# EAGLE design Rover-8_Power_Supply (EAGLE 7.7.0)
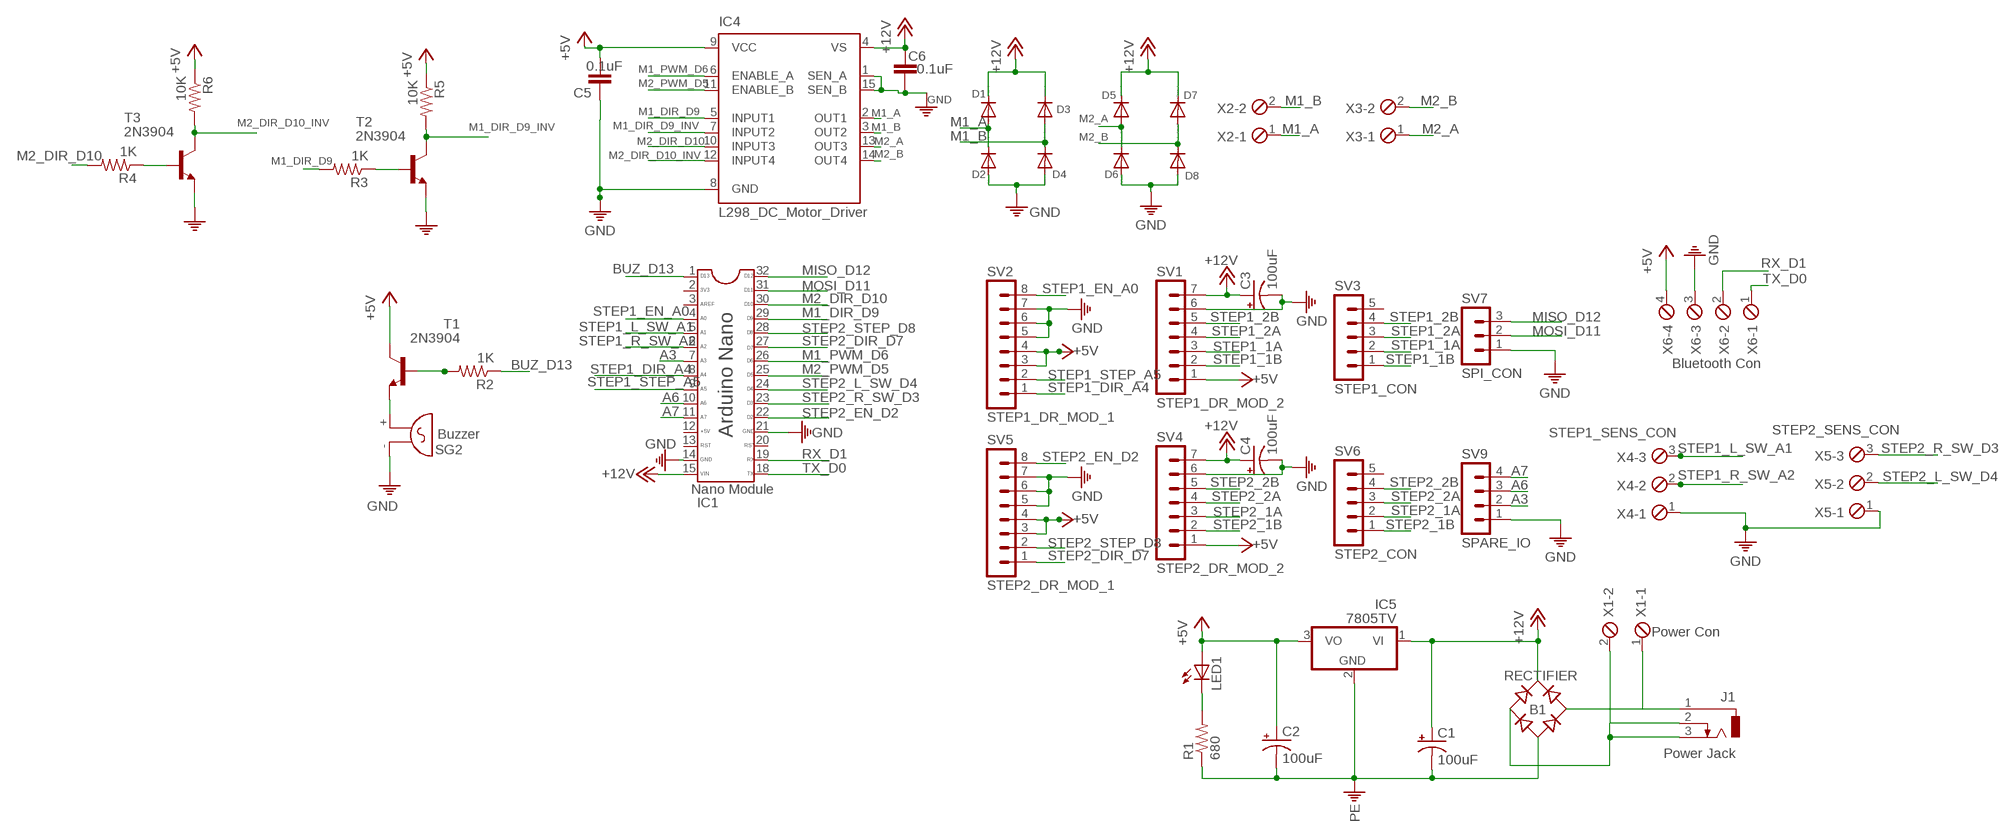
[diagram p0: schematic, sheet 1]

## Parts
B1  RECTIFIER  RB1A  [RB1A]
C1  100uF  CPOL-USE1.8-4  [E1,8-4]
C2  100uF  CPOL-USE1.8-4  [E1,8-4]
C3  100uF  CPOL-USE1.8-4  [E1,8-4]
C4  100uF  CPOL-USE1.8-4  [E1,8-4]
C5  0.1uF  C-EU025-024X044  [C025-024X044]
C6  0.1uF  C-EU025-024X044  [C025-024X044]
D1  DIODE-D-2.5  [D-2.5]
D2  DIODE-D-2.5  [D-2.5]
D3  DIODE-D-2.5  [D-2.5]
D4  DIODE-D-2.5  [D-2.5]
D5  DIODE-D-2.5  [D-2.5]
D6  DIODE-D-2.5  [D-2.5]
D7  DIODE-D-2.5  [D-2.5]
D8  DIODE-D-2.5  [D-2.5]
IC1  Nano Module  DIL32  [DIL32]
IC4  L298_DC_Motor_Driver  L298  [MULTIWATT-15]
IC5  7805TV  [TO220V]
J1  Power Jack  DCJ0303  [ROVER-PW-JACL]
LED1  LED3MM  [LED3MM]
R1  680  R-US_0204/5  [0204/5]
R2  1K  R-US_0204/5  [0204/5]
R3  1K  R-US_0204/5  [0204/5]
R4  1K  R-US_0204/5  [0204/5]
R5  10K  R-US_0204/5  [0204/5]
R6  10K  R-US_0204/5  [0204/5]
SG2  Buzzer  F/QMX  [F/QMX]
SV1  STEP1_DR_MOD_2  MA07-1  [MA07-1]
SV2  STEP1_DR_MOD_1  MA08-1  [MA08-1]
SV3  STEP1_CON  MA05-1  [MA05-1]
SV4  STEP2_DR_MOD_2  MA07-1  [MA07-1]
SV5  STEP2_DR_MOD_1  MA08-1  [MA08-1]
SV6  STEP2_CON  MA05-1  [MA05-1]
SV7  SPI_CON  MA03-1  [MA03-1]
SV9  SPARE_IO  MA04-1  [MA04-1]
T1  2N3904  [TO92]
T2  2N3904  [TO92]
T3  2N3904  [TO92]
X1  Power Con  MPT2  [2POL254]
X2  MPT2  [2POL254]
X3  MPT2  [2POL254]
X4  STEP1_SENS_CON  MPT3  [3POL254]
X5  STEP2_SENS_CON  MPT3  [3POL254]
X6  Bluetooth Con  MPT4  [4POL254]

## Nets
+5V: C2.+ C5.2 IC4.9(VCC) IC5.3(VO) LED1.A R5.1 R6.1 SV1.1 SV2.3 SV2.4 SV4.1 SV5.3 SV5.4 T1.1(C) X6.4
+12V: B1.+ C1.+ C3.+ C4.+ C6.2 D1.C D3.C D5.C D7.C IC1.15(VIN) IC4.4(VS) IC5.1(VI) SV1.7 SV4.7
A3: IC1.7(A3/D17) SV9.2
A6: IC1.10(A6) SV9.3
A7: IC1.11(A7) SV9.4
BUZ_D13: IC1.1(D13) R2.1
M1_A: D1.A D2.C IC4.2(OUT1) X2.1
M1_B: D3.A D4.C IC4.3(OUT2) X2.2
M1_DIR_D9: IC1.29(D9/PWM) IC4.5(INPUT1) R3.2
M1_DIR_D9_INV: IC4.7(INPUT2) R5.2 T2.1(C)
M1_PWM_D6: IC1.26(D6/PWM) IC4.6(ENABLE_A)
M2_A: D5.A D6.C IC4.13(OUT3) X3.1
M2_B: D7.A D8.C IC4.14(OUT4) X3.2
M2_DIR_D10: IC1.30(D10/PWM) IC4.10(INPUT3) R4.2
M2_DIR_D10_INV: IC4.12(INPUT4) R6.2 T3.1(C)
M2_PWM_D5: IC1.25(D5/PWM) IC4.11(ENABLE_B)
MISO_D12: IC1.32(D12/MISO) SV7.3
MOSI_D11: IC1.31(D11/MOSI) SV7.2
N$2: B1.AC1 J1.1 X1.1
N$3: B1.AC2 J1.2 J1.3 X1.2
N$4: LED1.K(C) R1.2
N$5: R4.1 T3.2(B)
N$6: R3.1 T2.2(B)
N$8: SG2.+ T1.3(E)
N$9: R2.2 T1.2(B)
PE: B1.- C1.- C2.- C3.- C4.- C5.1 C6.1 D2.A D4.A D6.A D8.A IC1.14(GND1) IC1.21(GND2) IC4.1(SEN_A) IC4.8(GND) IC4.15(SEN_B) IC5.2(GND) R1.1 SG2.- SV1.6 SV2.5 SV2.6 SV2.7 SV4.6 SV5.5 SV5.6 SV5.7 SV7.1 SV9.1 T2.3(E) T3.3(E) X4.1 X5.1 X6.3 ; supply symbol labelled GND
RX_D1: IC1.19(RX) X6.2
STEP1_1A: SV1.3 SV3.2
STEP1_1B: SV1.2 SV3.1
STEP1_2A: SV1.4 SV3.3
STEP1_2B: SV1.5 SV3.4
STEP1_DIR_A4: IC1.8(A4/D18/SDA) SV2.1
STEP1_EN_A0: IC1.4(A0/D14) SV2.8
STEP1_L_SW_A1: IC1.5(A1/D15) X4.3
STEP1_R_SW_A2: IC1.6(A2/D16) X4.2
STEP1_STEP_A5: IC1.9(A5/D19/SCL) SV2.2
STEP2_1A: SV4.3 SV6.2
STEP2_1B: SV4.2 SV6.1
STEP2_2A: SV4.4 SV6.3
STEP2_2B: SV4.5 SV6.4
STEP2_DIR_D7: IC1.27(D7) SV5.1
STEP2_EN_D2: IC1.22(D2) SV5.8
STEP2_L_SW_D4: IC1.24(D4) X5.2
STEP2_R_SW_D3: IC1.23(D3) X5.3
STEP2_STEP_D8: IC1.28(D8) SV5.2
TX_D0: IC1.18(TX) X6.1
Unconnected: IC1.2(3V3) IC1.3(AREF) IC1.12(5V) IC1.13(RST1) IC1.20(RST2) SV3.5 SV6.5

## Notes on the sheet
- D13 | D12
- 3V3 | D11
- AREF | D10
- Arduino Nano
- A0 | D9
- A1 | D8
- A2
- D7
- A3 | D6
- A4 | D5
- A5 | D4
- A6 | D3
- A7 | D2
- +5V | GND
- RST | RST
- GND | RX
- VIN | TX

## Library data of the parts
B1 = rectifier:RB1A: RECTIFIER 1 A
C1-C4 = rcl:CPOL-US: POLARIZED CAPACITOR, American symbol
C5 C6 = resistor:C-EU: CAPACITOR, European symbol
D1-D8 = diode:DIODE-: DIODE
IC1 = Nano-II_DIP_30P:DIL32: Dual In Line
IC4 = st-microelectronics:L298: DUAL FULL-BRIDGE DRIVER; MPN: L298N; OC_FARNELL: 1589425; OC_NEWARK: 32M1527
IC5 = linear:78*: Positive VOLTAGE REGULATOR Source: http://cache.national.com/ds/LM/LM78L05.pdf http://www.fairchildsemi.com/ds/LM/LM7805.pdf
J1 = Rover-PW-Jack:DCJ0303: DC POWER JACK Source: DCJ0303.pdf; OC_FARNELL: unknown; OC_NEWARK: unknown
LED1 = led:LED: LED OSRAM: - CHIPLED LG R971, LG N971, LY N971, LG Q971, LY Q971, LO R971, LY R971 LH N974, LH R974 LS Q976, LO Q976, LY Q976 LO Q996 - Hyper CHIPLED LW Q18S LB Q993, LB Q99A, LB R99A - SideLED LS A670, LO A670, LY A670, LG A670, LP A670 LB A673, LV A673, LT A673, LW A673 LH A674 LY A675 LS A676, LA A676, LO A676, LY A676, LW A676 LS A679, LY A679, LG A679 - Hyper Micro SIDELED® LS Y876, LA Y876, LO Y876, LY Y876 LT Y87S - SmartLED LW L88C, LW L88S LB L89C, LB L89S, LG L890 LS L89K, LO L89K, LY L89K LS L896, LA L896, LO L896, LY L896 - TOPLED LS T670, LO T670, LY T670, LG T670, LP T670 LSG T670, LSP T670, LSY T670, LOP T670, LYG T670 LG T671, LOG T671, LSG T671 LB T673, LV T673, LT T673, LW T673 LH T674 LS T676, LA T676, LO T676, LY T676, LB T676, LH T676, LSB T676, LW T676 LB T67C, LV T67C, LT T67C, LS T67K, LO T67K, LY T67K, LW E67C LS E67B, LA E67B, LO E67B, LY E67B, LB E67C, LV E67C, LT E67C LW T67C LS T679, LY T679, LG T679 LS T770, LO T770, LY T770, LG T770, LP T770 LB T773, LV T773, LT T773, LW T773 LH T774 LS E675, LA E675, LY E675, LS T675 LS T776, LA T776, LO T776, LY T776, LB T776 LHGB T686 LT T68C, LB T68C - Hyper Mini TOPLED® LB M676 - Mini TOPLED Santana® LG M470 LS M47K, LO M47K, LY M47K Source: http://www.osram.convergy.de LUXEON: - LUMILED® LXK2-PW12-R00, LXK2-PW12-S00, LXK2-PW14-U00, LXK2-PW14-V00 LXK2-PM12-R00, LXK2-PM12-S00, LXK2-PM14-U00 LXK2-PE12-Q00, LXK2-PE12-R00, LXK2-PE12-S00, LXK2-PE14-T00, LXK2-PE14-U00 LXK2-PB12-K00, LXK2-PB12-L00, LXK2-PB12-M00, LXK2-PB14-N00, LXK2-PB14-P00, LXK2-PB14-Q00 LXK2-PR12-L00, LXK2-PR12-M00, LXK2-PR14-Q00, LXK2-PR14-R00 LXK2-PD12-Q00, LXK2-PD12-R00, LXK2-PD12-S00 LXK2-PH12-R00, LXK2-PH12-S00 LXK2-PL12-P00, LXK2-PL12-Q00, LXK2-PL12-R00 Source: www.luxeon.com KINGBRIGHT: KA-3528ASYC Source: www.kingbright.com
R1-R6 = rcl:R-US_: RESISTOR, American symbol
SG2 = buzzer:F/QMX: BUZZER Source: Buerklin; OC_FARNELL: unknown; OC_NEWARK: unknown
SV1 SV4 = con-lstb:MA07-1: PIN HEADER; OC_FARNELL: unknown; OC_NEWARK: unknown
SV2 SV5 = con-lstb:MA08-1: PIN HEADER; OC_FARNELL: unknown; OC_NEWARK: unknown
SV3 SV6 = con-lstb:MA05-1: PIN HEADER; OC_FARNELL: unknown; OC_NEWARK: unknown
SV7 = con-lstb:MA03-1: PIN HEADER; OC_FARNELL: unknown; OC_NEWARK: unknown
SV9 = con-lstb:MA04-1: PIN HEADER; OC_FARNELL: unknown; OC_NEWARK: unknown
T1-T3 = transistor:2N3904: NPN TRANSISTOR
X1-X3 = con-phoenix-254:MPT2: PHOENIX CONNECTOR; OC_FARNELL: unknown; OC_NEWARK: unknown
X4 X5 = con-phoenix-254:MPT3: PHOENIX CONNECTOR; OC_FARNELL: unknown; OC_NEWARK: unknown
X6 = con-phoenix-254:MPT4: PHOENIX CONNECTOR; OC_FARNELL: unknown; OC_NEWARK: unknown

## Board
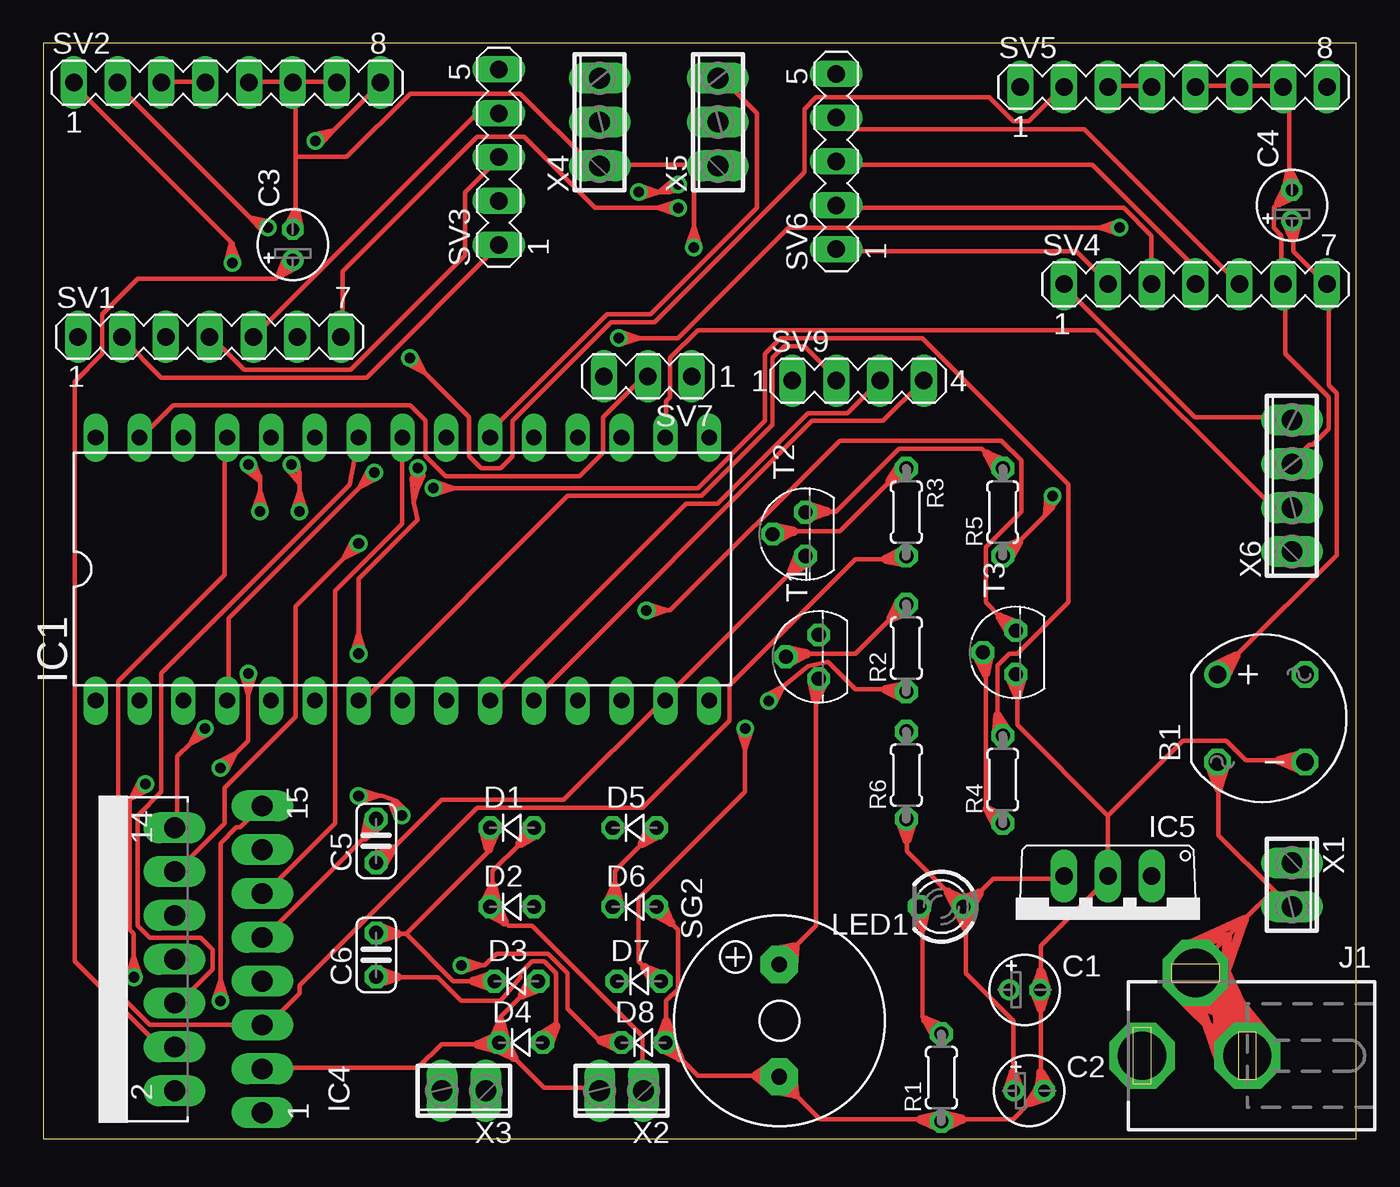
[diagram p1: board, top side]
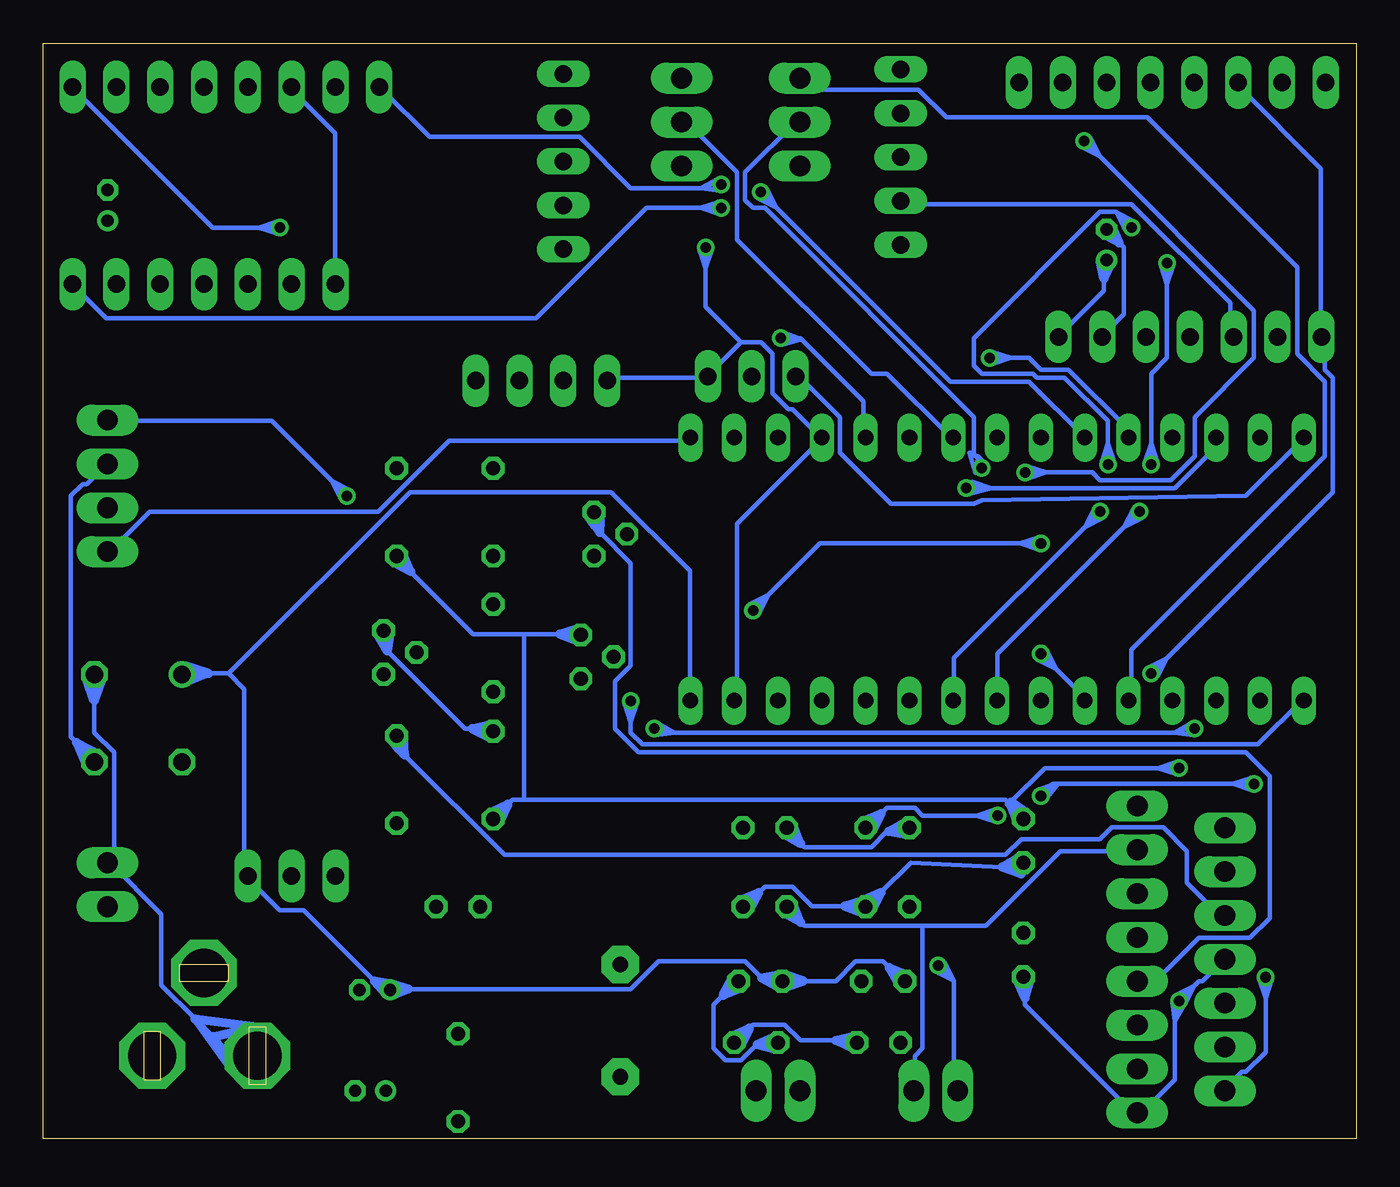
[diagram p2: board, bottom side, seen from below]

Size 76.12 x 63.49 mm. Coordinates in mm from the lower left corner, seen from the top.
Outline: 0,0 76.12,0 76.12,63.49 0,63.49 0,0
Copper layers (1*16): Top 0.035mm / dielectric 1.5mm / Bottom 0.035mm
Design rules "default": minimum track width 10mil, minimum drill 24mil, track to track 8mil, track to pad 8mil, pad to pad 8mil, via to via 8mil, smd to smd 8mil, copper to edge 40mil, drill to drill 8mil, minimum pad ring 10mil, minimum via ring 8mil, stop-mask expansion 4mil, vias tented up to drill 0mil, thermal gap 10mil

### Footprints (pad centres in the part's own frame; a part is rotated, then mirrored left to right if it is on the bottom)
RB1A = drill 1.016: + -2.54,2.54 | drill 1.016 octagon: - 2.54,-2.54; AC1 2.54,2.54; AC2 -2.54,-2.54
E1,8-4 = drill 0.711 pad 1.168: + -0.889,0 | drill 0.711 pad 1.168 octagon: - 0.889,0
C025-024X044 = drill 0.813 octagon: 1 -1.27,0; 2 1.27,0
D-2.5 = drill 0.813 octagon: A 1.27,0; C -1.27,0
DIL32 = drill 0.9 long: 1 -19.05,-7.62; 2 -16.51,-7.62; 3 -13.97,-7.62; 4 -11.43,-7.62; 5 -8.89,-7.62; 6 -6.35,-7.62; 7 -3.81,-7.62; 8 -1.27,-7.62; 9 1.27,-7.62; 10 3.81,-7.62; 11 6.35,-7.62; 12 8.89,-7.62; 13 11.43,-7.62; 14 13.97,-7.62; 15 16.51,-7.62; 18 16.51,7.62; 19 13.97,7.62; 20 11.43,7.62; 21 8.89,7.62; 22 6.35,7.62; 23 3.81,7.62; 24 1.27,7.62; 25 -1.27,7.62; 26 -3.81,7.62; 27 -6.35,7.62; 28 -8.89,7.62; 29 -11.43,7.62; 30 -13.97,7.62; 31 -16.51,7.62; 32 -19.05,7.62
MULTIWATT-15 = drill 1.2 long: 1 -8.89,-7.62; 2 -7.62,-2.54; 3 -6.35,-7.62; 4 -5.08,-2.54; 5 -3.81,-7.62; 6 -2.54,-2.54; 7 -1.27,-7.62; 8 0,-2.54; 9 1.27,-7.62; 10 2.54,-2.54; 11 3.81,-7.62; 12 5.08,-2.54; 13 6.35,-7.62; 14 7.62,-2.54; 15 8.89,-7.62
TO220V = drill 1.016 long: 1 -2.54,-2.54; 2 0,-2.54; 3 2.54,-2.54
ROVER-PW-JACL = drill 2.8 pad 3.81 octagon: 1 0,3.1; 2 4.8,0; 3 0,-3
LED3MM = drill 0.813 octagon: A -1.27,0; K 1.27,0
0204/5 = drill 0.813 octagon: 1 -2.54,0; 2 2.54,0
F/QMX = drill 0.914 pad 2.159 octagon: + 3.251,0; - -3.251,0
MA07-1 = drill 1.016 long: 1 -7.62,0; 2 -5.08,0; 3 -2.54,0; 4 0,0; 5 2.54,0; 6 5.08,0; 7 7.62,0
MA08-1 = drill 1.016 long: 1 -8.89,0; 2 -6.35,0; 3 -3.81,0; 4 -1.27,0; 5 1.27,0; 6 3.81,0; 7 6.35,0; 8 8.89,0
MA05-1 = drill 1.016 long: 1 -5.08,0; 2 -2.54,0; 3 0,0; 4 2.54,0; 5 5.08,0
MA03-1 = drill 1.016 long: 1 -2.54,0; 2 0,0; 3 2.54,0
MA04-1 = drill 1.016 long: 1 -3.81,0; 2 -1.27,0; 3 1.27,0; 4 3.81,0
TO92 = drill 0.813 octagon: 1 1.27,0; 2 0,1.905; 3 -1.27,0
2POL254 = drill 1.2 long: 1 -1.27,0; 2 1.27,0
3POL254 = drill 1.2 long: 1 -2.54,0; 2 0,0; 3 2.54,0
4POL254 = drill 1.2 long: 1 -3.81,0; 2 -1.27,0; 3 1.27,0; 4 3.81,0

### Placement (x,y rotation side)
B1  70.61,24.38 0 top
C1  56.9,8.64 0 top
C2  57.15,2.79 0 top
C3  14.48,51.82 90 top
C4  72.39,54.1 90 top
C5  19.3,17.27 90 top
C6  19.3,10.67 90 top
D1  27.18,18.03 0 top
D2  27.18,13.46 0 top
D3  27.43,9.14 0 top
D4  27.69,5.59 0 top
D5  34.29,18.03 0 top
D6  34.29,13.46 0 top
D7  34.54,9.14 0 top
D8  34.8,5.59 0 top
IC1  22.1,33.02 0 top
IC4  5.08,10.41 90 top
IC5  61.72,12.7 180 top
J1  66.8,4.83 90 top
LED1  52.07,13.46 180 top
R1  52.07,3.56 90 top
R2  50.04,28.45 90 top
R3  50.04,36.32 270 top
R4  55.63,20.83 90 top
R5  55.63,36.32 90 top
R6  50.04,21.08 90 top
SG2  42.67,6.86 90 top
SV1  9.65,46.48 0 top
SV2  10.67,61.21 0 top
SV3  26.42,56.9 90 top
SV4  66.8,49.53 0 top
SV5  65.53,60.96 0 top
SV6  45.97,56.64 90 top
SV7  35.05,44.2 180 top
SV9  47.24,43.94 0 top
T1  44.96,27.94 90 top
T2  44.2,35.05 90 top
T3  56.39,28.19 90 top
X1  72.39,14.73 270 top
X2  33.53,2.79 180 top
X3  24.38,2.79 180 top
X4  32.26,58.93 90 top
X5  39.12,58.93 90 top
X6  72.39,37.85 90 top

### Tracks (layer width: path | path; a pad name or v marks a point on that pad's centre or on a via)
+5V  (via drill 0.61)
  Top 0.254: SV5.4 64.24,61.04 61.72,61.04 SV5.3 | X6.4 72.24,41.83 66.75,41.83 59.21,49.38 SV4.1 | SV2.4 9.37,61.27 6.86,61.27 SV2.3 | C5.2 19.2,18.52 19.2,18.06 18.95,17.81 18.65,17.51 12.8,11.66 IC4.9 | C2.+ 56.24,2.97 56.24,3.5 56.24,3.86 56.24,6.86 53.49,9.6 53.49,12.25 53.49,12.66 53.49,13.26 LED1.A | R6.1 50.06,18.52 50.06,17.73 50.06,17.32 50.06,16.69 52.45,14.3 52.74,14.01 53.26,13.49 LED1.A | IC5.3 58.98,15.09 55.09,15.09 54.26,14.26 53.98,13.97 53.49,13.49 LED1.A | 11.89,25.76 11.89,23.09 11.15,22.35 | 11.89,25.76 11.89,26.06 | 11.89,26.06 v11.89,26.98 | v10.29,21.49 10.93,22.14 | 10.93,22.14 11.15,22.35 | v58.52,37.26 58.52,36.58 58.32,36.37 | 58.07,36.13 56.54,34.59 56.25,34.3 55.78,33.83 R5.1 | 58.07,36.13 58.32,36.37 | 11.89,26.06 12.23,26.82 v11.89,26.98 | 11.89,26.06 11.54,26.82 v11.89,26.98 | 10.93,22.14 10.15,21.85 v10.29,21.49 | 10.93,22.14 10.64,21.36 v10.29,21.49 | 58.32,36.37 58.82,37.03 v58.52,37.26 | 58.32,36.37 58.15,37.19 v58.52,37.26 | 11.89,25.76 12.25,26.86 v11.89,26.98 | 11.89,25.76 11.53,26.86 v11.89,26.98 | 11.15,22.35 10.12,21.83 v10.29,21.49 | 11.15,22.35 10.63,21.32 v10.29,21.49 | 58.07,36.13 58.81,37.02 v58.52,37.26 | 58.07,36.13 58.14,37.28 v58.52,37.26
  Top 0.508: R5.1 55.56,34.18 56.25,34.3 56.01,33.64 R5.1 | LED1.A 53.72,13.33 53.49,12.66 53.03,13.2 LED1.A | LED1.A 52.95,13.34 52.74,14.01 53.43,13.86 LED1.A | LED1.A 53.28,13.86 53.98,13.97 53.72,13.31 LED1.A | R6.1 50.4,18.35 50.06,17.73 49.69,18.33 R6.1 | C5.2 19.53,18.21 18.95,17.81 18.9,18.51 C5.2 | C2.+ 55.95,2.96 56.24,3.5 56.56,2.98 C2.+ | R5.1 55.47,34.16 56.54,34.59 55.98,33.59 R5.1 | LED1.A 53.74,13.38 53.49,12.25 52.98,13.28 LED1.A | LED1.A 52.98,13.28 52.45,14.3 53.5,13.83 LED1.A | LED1.A 53.19,13.84 54.26,14.26 53.69,13.26 LED1.A | R6.1 50.42,18.41 50.06,17.32 49.66,18.4 R6.1 | C5.2 19.56,18.22 18.65,17.51 18.91,18.63 C5.2 | C2.+ 55.92,2.9 56.24,3.86 56.59,2.92 C2.+
  Bottom 0.254: SV4.1 59.21,49.61 59.21,58.29 61.72,60.81 SV5.3 | SV2.3 6.86,61.04 2.06,56.24 2.06,46.63 SV1.1 1.83,46.41 1.83,44.58 1.37,44.12 1.37,37.49 11.03,27.84 | 48.23,29.26 51.21,29.26 54.82,32.87 55.1,33.16 55.55,33.6 R5.1 | 48.23,29.26 46.18,29.26 45.77,29.26 45.03,29.26 T1.1 | 20.12,19.43 20.13,19.44 20.34,19.66 48.23,19.66 | 20.12,19.43 19.84,19.15 19.43,18.75 C5.2 | 48.23,19.66 48.92,19.66 49.18,19.4 49.46,19.12 R6.1 | 48.23,19.66 48.23,29.26 | v11.89,26.98 11.24,27.62 | 11.24,27.62 11.03,27.84 | 11.51,21.49 18.06,21.49 20.02,19.53 20.12,19.43 | 11.51,21.49 11.2,21.49 | 11.2,21.49 v10.29,21.49 | v58.52,37.26 59.17,37.91 | 59.17,37.91 59.38,38.12 | 59.38,38.12 62.87,41.6 72.24,41.6 X6.4 | 11.24,27.62 11.53,26.84 v11.89,26.98 | 11.24,27.62 12.02,27.33 v11.89,26.98 | 11.2,21.49 10.45,21.84 v10.29,21.49 | 11.2,21.49 10.45,21.14 v10.29,21.49 | 59.17,37.91 58.39,37.62 v58.52,37.26 | 59.17,37.91 58.88,37.13 v58.52,37.26 | 11.03,27.84 11.55,26.8 v11.89,26.98 | 11.03,27.84 12.06,27.32 v11.89,26.98 | 11.51,21.49 10.41,21.85 v10.29,21.49 | 11.51,21.49 10.41,21.13 v10.29,21.49 | 59.38,38.12 58.35,37.6 v58.52,37.26 | 59.38,38.12 58.86,37.09 v58.52,37.26
  Bottom 0.508: T1.1 45.14,29.57 45.77,29.26 45.18,28.87 T1.1 | R5.1 55.77,33.4 55.1,33.16 55.23,33.85 R5.1 | R6.1 49.65,18.44 49.46,19.12 50.14,18.93 R6.1 | C5.2 19.17,18.93 19.84,19.15 19.7,18.46 C5.2 | T1.1 45.08,29.6 46.18,29.26 45.11,28.83 T1.1 | R5.1 55.82,33.43 54.82,32.87 55.25,33.94 R5.1 | R6.1 49.67,18.37 49.18,19.4 50.21,18.91 R6.1 | C5.2 19.11,18.9 20.13,19.44 19.68,18.38 C5.2 | C5.2 19.07,18.88 20.02,19.53 19.69,18.43 C5.2
+12V  (via drill 0.61)
  Top 0.254: IC4.4 7.54,5.49 6.63,5.49 1.83,10.29 1.83,43.89 3.43,45.49 3.43,47.78 5.49,49.84 13.49,49.84 13.78,50.12 14.03,50.38 14.4,50.75 C3.+ | 21.03,11.89 20.52,11.89 20.11,11.89 19.43,11.89 C6.2 | 21.03,11.89 23.77,9.14 24.94,9.14 25.35,9.14 D3.C | 21.03,11.89 25.83,16.69 25.83,16.82 25.83,17.23 25.83,17.83 D1.C | C4.+ 72.47,53.03 72.47,52.51 72.47,52.15 72.47,51.44 74.3,49.61 SV4.7 74.52,49.38 74.52,43.66 74.98,43.2 74.98,33.83 69.15,28 68.79,27.64 B1.+ | v36.8,53.95 35.89,53.95 | 35.89,53.95 35.59,53.95 | 35.59,53.95 32,53.95 27.89,58.06 25.15,58.06 17.37,50.29 17.37,46.63 SV1.7 | 35.89,53.95 36.65,53.6 v36.8,53.95 | 35.89,53.95 36.65,54.3 v36.8,53.95 | 35.59,53.95 36.69,53.59 v36.8,53.95 | 35.59,53.95 36.69,54.31 v36.8,53.95
  Top 0.508: C6.2 19.53,12.28 20.11,11.89 19.48,11.57 C6.2 | D1.C 26.24,17.8 25.83,17.23 25.54,17.86 D1.C | D3.C 25.96,8.79 25.35,9.14 25.96,9.5 D3.C | B1.+ 67.94,27.41 68.79,27.64 68.56,26.79 B1.+ | C4.+ 72.72,53.07 72.47,52.51 72.1,53 C4.+ | C3.+ 14.6,50.59 14.03,50.38 14.13,50.98 C3.+ | C6.2 19.45,12.31 20.52,11.89 19.42,11.55 C6.2 | D1.C 26.28,17.88 25.83,16.82 25.52,17.92 D1.C | D3.C 26.03,8.76 24.94,9.14 26.03,9.53 D3.C | B1.+ 67.85,27.38 69.15,28 68.53,26.7 B1.+ | C4.+ 72.73,53.12 72.47,52.15 72.06,53.07 C4.+ | C3.+ 14.65,50.62 13.78,50.12 14.15,51.06 C3.+
  Bottom 0.254: C3.+ 14.63,50.75 14.63,50.23 14.63,49.87 14.63,49.15 17.14,46.63 SV1.7 | D1.C 26.06,17.83 26.7,17.83 27.11,17.83 27.2,17.83 28.12,16.92 32,16.92 32.21,17.12 32.5,17.41 32.92,17.83 D5.C | D3.C 26.29,9.14 26.8,9.65 27.09,9.94 27.43,10.29 29.03,10.29 30.18,9.14 32.05,9.14 32.46,9.14 D7.C 34.09,9.14 34.29,9.14 34.48,9.33 35.43,10.29 40.46,10.29 42.06,8.69 54.94,8.69 55.3,8.69 56.01,8.69 | 56.01,8.69 56.46,8.69 56.67,8.89 56.94,9.16 61.04,13.26 62.41,13.26 64.24,15.09 IC5.1 64.47,15.32 64.47,26.06 65.38,26.98 | 65.38,26.98 54.86,37.49 43.2,37.49 38.63,32.92 38.63,25.6 IC1.15 | 65.38,26.98 66.55,26.98 67.06,26.98 67.89,26.98 B1.+ | 56.01,8.69 C1.+ | 38.02,53.95 41.15,53.95 47.55,47.55 72.47,47.55 74.3,49.38 SV4.7 | 38.02,53.95 37.72,53.95 | 37.72,53.95 v36.8,53.95 | 37.72,53.95 36.96,54.3 v36.8,53.95 | 37.72,53.95 36.96,53.6 v36.8,53.95 | 38.02,53.95 36.92,54.31 v36.8,53.95 | 38.02,53.95 36.92,53.59 v36.8,53.95
  Bottom 0.508: D1.C 26.19,18.32 26.7,17.83 26.02,17.64 D1.C | D3.C 26.1,9.55 26.8,9.65 26.54,9 D3.C | D5.C 33.16,17.65 32.5,17.41 32.62,18.1 D5.C | D7.C 33.07,8.79 32.46,9.14 33.07,9.5 D7.C | D7.C 33.48,9.5 34.09,9.14 33.48,8.79 D7.C | B1.+ 67.8,26.5 67.06,26.98 67.84,27.38 B1.+ | C1.+ 56.06,8.99 56.67,8.89 56.28,8.41 C1.+ | C1.+ 55.81,8.34 55.3,8.69 55.85,8.96 C1.+ | C3.+ 14.82,50.82 14.63,50.23 14.21,50.69 C3.+ | D1.C 26.11,18.39 27.11,17.83 25.98,17.63 D1.C | D3.C 26.01,9.52 27.09,9.94 26.52,8.94 D3.C | D5.C 33.22,17.68 32.21,17.12 32.64,18.19 D5.C | D7.C 33.14,8.76 32.05,9.14 33.14,9.53 D7.C | D7.C 33.35,9.54 34.48,9.33 33.47,8.79 D7.C | B1.+ 67.89,26.45 66.55,26.98 67.92,27.41 B1.+ | C1.+ 55.95,8.99 56.94,9.16 56.27,8.4 C1.+ | C1.+ 55.87,8.31 54.94,8.69 55.91,8.98 C1.+ | C3.+ 14.83,50.86 14.63,49.87 14.16,50.76 C3.+
A3
  Top 0.254: IC1.7 18.29,25.6 18.75,25.6 30.4,37.26 38.18,37.26 42.29,41.38 42.29,45.26 42.98,45.95 44.12,45.95 45.95,44.12 SV9.2
A6
  Top 0.254: SV9.3 46.63,42.06 44.35,42.06 39.09,36.8 37.26,36.8 26.06,25.6 IC1.10
A7
  Top 0.254: IC1.11 28.57,25.6 44.58,41.6 48.69,41.6 50.98,43.89 SV9.4
BUZ_D13  (via drill 0.61)
  Top 0.254: v42.06,25.38 42.71,26.02 | 42.71,26.02 42.92,26.24 | 42.92,26.24 44.35,27.41 45.49,27.66 47.09,26.06 48.83,26.06 49.24,26.06 49.84,26.06 R2.1 | 42.71,26.02 41.93,25.73 v42.06,25.38 | 42.71,26.02 42.42,25.24 v42.06,25.38 | 42.92,26.24 41.89,25.71 v42.06,25.38 | 42.92,26.24 42.4,25.2 v42.06,25.38
  Top 0.508: R2.1 49.77,25.6 49.24,26.06 49.9,26.29 R2.1 | R2.1 49.86,25.55 48.83,26.06 49.95,26.3 R2.1
  Bottom 0.254: 42.06,24.16 42.06,23.55 41.38,22.86 5.71,22.86 3.2,25.38 IC1.1 | 42.06,24.16 42.06,24.46 | 42.06,24.46 v42.06,25.38 | 42.06,24.46 42.41,25.22 v42.06,25.38 | 42.06,24.46 41.72,25.22 v42.06,25.38 | 42.06,24.16 42.42,25.26 v42.06,25.38 | 42.06,24.16 41.7,25.26 v42.06,25.38
M1_A  (via drill 0.61)
  Top 0.254: D1.A 28.35,17.83 27.93,17.41 27.64,17.12 26.06,15.54 26.06,14.67 26.06,14.26 26.06,13.49 D2.C 26.06,13.26 26.46,12.86 26.74,12.57 26.98,12.34 28.35,12.34 34.75,5.94 34.75,2.97 X2.1 | 5.26,10.59 5.26,11.89 5.03,12.12 5.03,19.66 5.08,19.71 | 5.26,10.59 5.26,10.29 | 5.26,10.29 v5.26,9.37 | v5.94,20.57 5.3,19.93 | 5.3,19.93 5.08,19.71 | 19.51,19.89 19.66,19.89 20.45,19.61 | 19.51,19.89 19.2,19.89 | 19.2,19.89 v18.29,19.89 | v20.8,18.75 20.16,19.39 | 20.16,19.39 20.45,19.61 | 5.26,10.29 4.91,9.53 v5.26,9.37 | 5.26,10.29 5.6,9.53 v5.26,9.37 | 5.3,19.93 6.08,20.22 v5.94,20.57 | 5.3,19.93 5.59,20.71 v5.94,20.57 | 19.2,19.89 18.45,20.23 v18.29,19.89 | 19.2,19.89 18.45,19.54 v18.29,19.89 | 20.16,19.39 20.45,18.61 v20.8,18.75 | 20.16,19.39 20.93,19.1 v20.8,18.75 | 5.26,10.59 4.9,9.49 v5.26,9.37 | 5.26,10.59 5.62,9.49 v5.26,9.37 | 5.08,19.71 6.12,20.23 v5.94,20.57 | 5.08,19.71 5.6,20.75 v5.94,20.57 | 19.51,19.89 18.41,20.25 v18.29,19.89 | 19.51,19.89 18.41,19.53 v18.29,19.89 | 20.45,19.61 20.97,18.57 v20.8,18.75 | 20.45,19.61 20.97,19.09 v20.8,18.75
  Top 0.508: D2.C 25.6,13.73 26.06,14.26 26.29,13.6 D2.C | 26.3,13.55 26.46,12.86 25.79,13.07 D2.C | 26.3,13.55 D2.C | D1.A 28.59,17.65 27.93,17.41 28.05,18.1 D1.A | D2.C 25.55,13.64 26.06,14.67 26.3,13.55 | D2.C 26.3,13.55 | D2.C 26.28,13.63 26.74,12.57 25.72,13.1 D2.C | D1.A 28.64,17.68 27.64,17.12 28.07,18.19 D1.A
  Bottom 0.254: v5.26,9.37 5.26,8.46 | 5.26,8.46 5.26,8.15 | 5.26,8.15 5.26,5.03 6.4,3.89 6.63,3.89 7.54,2.97 IC4.2 | 17.28,20.57 17.6,20.57 17.64,20.54 | 17.28,20.57 7.16,20.57 | 7.16,20.57 6.86,20.57 | 6.86,20.57 v5.94,20.57 | v18.29,19.89 17.64,20.54 | 22.02,18.75 25.15,18.75 25.6,19.2 27.2,19.2 27.55,18.86 27.84,18.57 28.35,18.06 D1.A | 22.02,18.75 21.72,18.75 | 21.72,18.75 v20.8,18.75 | 5.26,8.46 5.6,9.21 v5.26,9.37 | 5.26,8.46 4.91,9.21 v5.26,9.37 | 6.86,20.57 6.1,20.92 v5.94,20.57 | 6.86,20.57 6.1,20.23 v5.94,20.57 | 17.64,20.54 17.93,19.76 v18.29,19.89 | 17.64,20.54 18.42,20.25 v18.29,19.89 | 21.72,18.75 20.96,19.09 v20.8,18.75 | 21.72,18.75 20.96,18.4 v20.8,18.75 | 5.26,8.15 5.62,9.25 v5.26,9.37 | 5.26,8.15 4.9,9.25 v5.26,9.37 | 7.16,20.57 6.06,20.94 v5.94,20.57 | 7.16,20.57 6.06,20.21 v5.94,20.57 | 17.28,20.57 17.99,19.66 v18.29,19.89 | 17.28,20.57 18.39,20.25 v18.29,19.89 | 22.02,18.75 20.92,19.11 v20.8,18.75 | 22.02,18.75 20.92,18.38 v20.8,18.75
  Bottom 0.508: D1.A 28.06,17.9 27.84,18.57 28.53,18.43 D1.A | D1.A 28.09,17.84 27.55,18.86 28.61,18.41 D1.A
M1_B
  Top 0.254: D4.C 26.52,5.71 26.52,6.39 26.52,6.8 26.52,7.09 27.78,8.35 28.07,8.64 28.57,9.14 D3.A | D4.C 26.99,5.01 27.28,4.73 29.03,2.97 32.23,2.97 X2.2 | IC4.3 12.8,4.12 21.72,4.12 23.09,5.49 25.2,5.49 25.61,5.49 26.29,5.49 D4.C
  Top 0.508: D4.C 26.09,5.83 26.52,6.39 26.79,5.75 D4.C | D4.C 26.81,5.69 26.99,5.01 26.31,5.2 D4.C | D4.C 26.26,5.21 25.61,5.49 26.17,5.91 D4.C | D3.A 28.76,8.74 28.07,8.64 28.32,9.29 D3.A | D4.C 26.05,5.75 26.52,6.8 26.81,5.69 D4.C | D4.C 26.78,5.76 27.28,4.73 26.24,5.22 D4.C | D4.C 26.31,5.2 25.2,5.49 26.25,5.96 D4.C | D3.A 28.85,8.77 27.78,8.35 28.35,9.35 D3.A
M1_DIR_D9
  Top 0.254: R3.2 49.84,33.6 49.24,33.6 48.83,33.6 47.09,33.6 39.78,26.29 39.78,24.23 34.75,19.2 25.15,19.2 14.86,8.91 14.86,8.46 12.8,6.4 IC4.5 12.57,6.63 6.17,6.63 4.34,8.46 4.34,26.52 10.52,32.69 10.52,40.46 IC1.29
  Top 0.508: R3.2 49.92,33.39 49.24,33.6 49.76,34.08 R3.2 | R3.2 49.96,33.38 48.83,33.6 49.85,34.14 R3.2
M1_DIR_D9_INV
  Top 0.254: T2.1 44.35,36.35 45.01,36.35 45.41,36.35 45.95,36.35 49.61,40.01 54.41,40.01 54.73,39.69 55.01,39.4 55.55,38.86 R5.2
  Top 0.508: R5.2 55.24,38.73 55.01,39.4 55.7,39.26 R5.2 | T2.1 44.39,36.68 45.01,36.35 44.41,35.98 T2.1 | R5.2 55.27,38.67 54.73,39.69 55.78,39.24 R5.2 | T2.1 44.32,36.71 45.41,36.35 44.34,35.94 T2.1
  Bottom 0.254: IC4.7 11.66,9.14 9.14,11.66 6.17,11.66 5.03,12.8 5.03,21.03 6.4,22.4 41.6,22.4 42.98,23.77 42.98,26.52 42.06,27.43 42.06,33.38 43.84,35.16 44.12,35.43 44.12,35.51 44.12,36.12 T2.1
  Bottom 0.508: T2.1 44.53,36.09 44.12,35.51 43.83,36.15 T2.1 | T2.1 44.52,36.08 43.84,35.16 43.79,36.3 T2.1
M1_PWM_D6
  Top 0.254: IC1.26 17.78,37.9 6.86,26.98 6.86,20.12 5.49,18.75 5.49,12.34 6.17,11.66 9.14,11.66 9.83,10.97 9.83,9.83 7.77,7.77 IC4.6
M2_A
  Top 0.254: D6.C 33.15,13.49 33.15,14.27 33.15,14.68 33.15,15.54 34.74,17.14 35.02,17.42 35.43,17.83 D5.A
  Top 0.508: D5.A 35.69,17.65 35.02,17.42 35.16,18.11 D5.A | D6.C 32.7,13.72 33.15,14.27 33.4,13.61 D6.C | D5.A 35.75,17.68 34.74,17.14 35.19,18.19 D5.A | D6.C 32.65,13.64 33.15,14.68 33.41,13.56 D6.C
  Bottom 0.254: 25.15,12.34 32,12.34 32.21,12.55 32.5,12.84 32.92,13.26 D6.C | 25.15,12.34 21.49,12.34 17.14,16.69 12.8,16.69 IC4.13 | 25.15,12.34 25.15,5.26 25.6,4.8 25.6,2.97 X3.1
  Bottom 0.508: D6.C 33.16,13.08 32.5,12.84 32.62,13.53 D6.C | D6.C 33.22,13.11 32.21,12.55 32.64,13.62 D6.C
M2_B  (via drill 0.61)
  Top 0.254: 25.45,10.06 25.6,10.06 26.29,10.74 29.26,10.74 30.4,9.6 30.4,7.54 32.23,5.71 32.31,5.71 32.73,5.71 33.38,5.71 D8.C | 25.45,10.06 25.15,10.06 | 25.15,10.06 v24.23,10.06 | v9.37,23.77 8.73,23.13 | 8.73,23.13 8.51,22.91 | 8.51,22.91 7.77,22.17 7.77,18.06 IC4.14 | 40.69,22.55 40.69,20.12 34.52,13.95 34.52,10.29 34.88,9.93 35.17,9.64 35.66,9.14 D7.A | 40.69,22.55 40.69,22.86 | 40.69,22.86 v40.69,23.77 | 25.15,10.06 24.39,10.4 v24.23,10.06 | 25.15,10.06 24.39,9.71 v24.23,10.06 | 8.73,23.13 9.51,23.42 v9.37,23.77 | 8.73,23.13 9.02,23.91 v9.37,23.77 | 40.69,22.86 41.04,23.62 v40.69,23.77 | 40.69,22.86 40.34,23.62 v40.69,23.77 | 25.45,10.06 24.35,10.42 v24.23,10.06 | 25.45,10.06 24.35,9.7 v24.23,10.06 | 8.51,22.91 9.54,23.43 v9.37,23.77 | 8.51,22.91 9.03,23.95 v9.37,23.77 | 40.69,22.55 41.05,23.66 v40.69,23.77 | 40.69,22.55 40.33,23.66 v40.69,23.77
  Top 0.508: D7.A 35.44,8.99 35.17,9.64 35.87,9.55 D7.A | D8.C 33.27,5.27 32.73,5.71 33.38,5.97 D8.C | D7.A 35.46,8.94 34.88,9.93 35.96,9.53 D7.A | D8.C 33.35,5.22 32.31,5.71 33.43,5.98 D8.C
  Bottom 0.254: D8.C 33.6,5.49 34.33,5.49 34.74,5.49 34.75,5.49 35.66,4.57 36.58,4.57 37.26,5.26 37.26,7.77 36.71,8.32 36.43,8.61 35.89,9.14 D7.A | v24.23,10.06 23.59,9.41 | 23.59,9.41 23.37,9.2 | 23.37,9.2 23.32,9.14 23.32,2.97 X3.2 | v9.37,23.77 10.06,23.77 10.26,23.57 | 10.26,23.57 10.29,23.55 10.57,23.55 | 39.8,23.55 40.46,23.55 v40.69,23.77 | 39.8,23.55 39.49,23.55 | 39.49,23.55 10.57,23.55 | 23.59,9.41 24.36,9.7 v24.23,10.06 | 23.59,9.41 23.87,10.19 v24.23,10.06 | 10.26,23.57 9.61,24.08 v9.37,23.77 | 10.26,23.57 9.45,23.4 v9.37,23.77 | 39.8,23.55 40.62,23.4 v40.69,23.77 | 39.8,23.55 40.45,24.07 v40.69,23.77 | 23.37,9.2 24.4,9.72 v24.23,10.06 | 23.37,9.2 23.89,10.23 v24.23,10.06 | 10.57,23.55 9.56,24.11 v9.37,23.77 | 10.57,23.55 9.42,23.4 v9.37,23.77 | 39.49,23.55 40.64,23.4 v40.69,23.77 | 39.49,23.55 40.51,24.11 v40.69,23.77
  Bottom 0.508: D7.A 36.2,9.28 36.43,8.61 35.73,8.74 D7.A | D8.C 33.77,5.91 34.33,5.49 33.69,5.21 D8.C | D7.A 36.17,9.34 36.71,8.32 35.66,8.77 D7.A | D8.C 33.7,5.96 34.74,5.49 33.63,5.2 D8.C
M2_DIR_D10  (via drill 0.61)
  Top 0.254: 23.85,37.72 37.95,37.72 41.83,41.6 41.83,45.49 42.75,46.41 50.98,46.41 59.44,37.95 59.44,31.09 56.46,28.12 56.01,28.12 55.32,27.43 55.32,24.55 55.32,24.12 55.32,23.77 55.55,23.55 R4.2 | 23.85,37.72 23.55,37.72 | 23.55,37.72 v22.63,37.72 | 23.55,37.72 22.79,38.06 v22.63,37.72 | 23.55,37.72 22.79,37.37 v22.63,37.72 | 23.85,37.72 22.75,38.08 v22.63,37.72 | 23.85,37.72 22.75,37.36 v22.63,37.72
  Top 0.508: R4.2 55.22,23.42 55.32,24.12 55.88,23.69 R4.2 | R4.2 55.22,23.4 55.32,24.55 55.96,23.59 R4.2
  Bottom 0.254: R4.2 55.55,23.32 55.55,22.63 55.49,22.57 55.16,22.24 49.38,16.46 20.34,16.46 19.43,17.37 14.86,17.37 14.17,18.06 11.2,18.06 9.83,16.69 9.83,14.86 7.77,12.8 IC4.10 | v22.63,37.72 21.72,37.72 | 21.72,37.72 21.16,37.72 | 21.16,37.72 10.52,37.72 8.23,40.01 8.23,40.46 IC1.30 | 21.72,37.72 22.47,37.37 v22.63,37.72 | 21.72,37.72 22.47,38.06 v22.63,37.72 | 21.16,37.72 22.51,37.36 v22.63,37.72 | 21.16,37.72 22.26,38.08 v22.63,37.72
  Bottom 0.508: R4.2 55.94,23.11 55.49,22.57 55.24,23.23 R4.2 | R4.2 55.93,23.1 55.16,22.24 55.22,23.39 R4.2
M2_DIR_D10_INV  (via drill 0.61)
  Top 0.254: v18.29,34.52 17.64,33.87 | 17.64,33.87 17.43,33.66 | 17.43,33.66 14.63,30.86 14.63,24.46 10.52,20.34 10.52,18.29 7.77,15.54 IC4.12 | 36.2,30.63 36.35,30.63 46.18,40.46 55.55,40.46 56.69,39.32 56.69,36.35 54.63,34.29 54.63,31.09 55.47,30.26 55.75,29.97 56.24,29.49 T3.1 | 36.2,30.63 35.89,30.63 | 35.89,30.63 v34.98,30.63 | 17.64,33.87 18.42,34.16 v18.29,34.52 | 17.64,33.87 17.93,34.65 v18.29,34.52 | 35.89,30.63 35.13,30.98 v34.98,30.63 | 35.89,30.63 35.13,30.29 v34.98,30.63 | 17.43,33.66 18.46,34.18 v18.29,34.52 | 17.43,33.66 17.95,34.69 v18.29,34.52 | 36.2,30.63 35.09,30.99 v34.98,30.63 | 36.2,30.63 35.09,30.27 v34.98,30.63
  Top 0.508: T3.1 56.01,29.32 55.75,29.97 56.45,29.87 T3.1 | T3.1 56.03,29.26 55.47,30.26 56.54,29.84 T3.1
  Bottom 0.254: R6.2 50.06,23.77 50.84,23.77 51.25,23.77 51.66,23.77 56.16,28.27 56.24,28.35 56.24,28.67 56.24,29.26 T3.1 | 19.51,34.52 31.09,34.52 34.11,31.5 | 19.51,34.52 19.2,34.52 | 19.2,34.52 v18.29,34.52 | v34.98,30.63 34.33,31.28 | 34.33,31.28 34.11,31.5 | 19.2,34.52 18.45,34.87 v18.29,34.52 | 19.2,34.52 18.45,34.17 v18.29,34.52 | 34.33,31.28 34.62,30.5 v34.98,30.63 | 34.33,31.28 35.11,30.99 v34.98,30.63 | 19.51,34.52 18.41,34.88 v18.29,34.52 | 19.51,34.52 18.41,34.16 v18.29,34.52 | 34.11,31.5 34.64,30.46 v34.98,30.63 | 34.11,31.5 35.15,30.97 v34.98,30.63
  Bottom 0.508: R6.2 50.17,24.01 50.84,23.77 50.3,23.31 R6.2 | T3.1 56.7,29.2 56.24,28.67 56,29.33 T3.1 | R6.2 50.12,24.02 51.25,23.77 50.22,23.26 R6.2 | T3.1 56.74,29.26 56.16,28.27 55.99,29.4 T3.1
M2_PWM_D5
  Top 0.254: IC1.25 20.8,40.46 20.8,35.66 16.92,31.77 16.92,18.29 12.8,14.17 IC4.11
MISO_D12
  Bottom 0.254: IC1.32 3.2,40.46 6.4,37.26 21.72,37.01 22.17,36.8 26.98,36.8 29.95,39.78 29.95,41.83 32.46,44.35 SV7.3
MOSI_D11
  Top 0.254: IC1.31 5.71,40.69 7.54,42.52 21.26,42.52 22.17,41.6 22.17,39.55 23.32,38.41 31.09,38.41 32.46,39.78 32.46,41.83 34.98,44.35 SV7.2
N$2
  Bottom 0.254: B1.AC1 73.15,25.91 73.15,25.4 73.15,23.55 72.01,22.4 72.01,16.23 72.24,16 | 72.24,16 69.27,13.03 69.27,8.91 67.32,6.97 66.28,5.93 65.38,5.03 63.78,5.03 J1.1 | 72.24,16 X1.1
  Bottom 0.508: J1.1 64.08,6.44 66.28,5.93 65.12,3.98 J1.1 | B1.AC1 73.59,26.67 73.15,25.91 72.71,26.67 B1.AC1 | J1.1 63.49,6.47 67.32,6.97 65.04,3.85 J1.1 | B1.AC1 73.63,26.75 73.15,25.4 72.67,26.75 B1.AC1
N$3
  Top 0.254: 71.32,14.4 72.24,13.49 X1.2 | 71.32,14.4 68.12,17.6 68.12,20.32 68.12,20.83 68.12,21.72 B1.AC2 | 71.32,14.4 69.64,12.72 68.65,11.73 66.75,9.83 J1.2 66.98,9.6 67.97,8.61 68.86,7.72 69.06,7.53 69.72,6.86 69.72,6.61 69.72,5.03 J1.3
  Top 0.508: J1.2 66.44,11.24 68.65,11.73 68.45,9.48 J1.2 | J1.2 68.43,9.94 68.86,7.72 66.61,7.98 J1.2 | 68.38,5.73 69.06,7.53 70.83,6.12 J1.3 | 68.38,5.73 68.25,5.41 J1.3 | B1.AC2 68.52,21.61 68.12,20.83 67.64,21.57 B1.AC2 | J1.2 66.12,11.13 69.64,12.72 68.36,9.08 J1.2 | J1.2 68.35,10.21 69.72,6.61 66.16,8.1 J1.2 | 68.38,5.73 68.46,9.59 J1.2 | 68.38,5.73 65.64,8.45 J1.2 | J1.2 68.3,10.33 69.94,6.83 66.28,8.06 J1.2 | J1.3 68.15,4.75 67.97,8.61 70.89,6.07 J1.3 | J1.3 68.16,5.03 68.64,8.86 71.08,5.87 J1.3 | J1.3 68.24,4.29 66.98,7.94 70.49,6.33 J1.3 | B1.AC2 68.56,21.69 68.12,20.32 67.6,21.66 B1.AC2
N$4
  Top 0.254: LED1.K 50.98,13.26 50.98,12.67 50.98,12.26 50.98,7.09 51.16,6.91 51.45,6.62 51.89,6.17 R1.2
  Top 0.508: LED1.K 51.19,13.34 50.98,12.67 50.5,13.19 LED1.K | R1.2 51.69,5.96 51.45,6.62 52.14,6.5 R1.2 | LED1.K 51.2,13.38 50.98,12.26 50.44,13.27 LED1.K | R1.2 51.71,5.9 51.16,6.91 52.22,6.47 R1.2
N$5
  Top 0.254: T3.2 54.63,28.12 54.63,27.4 54.63,26.98 54.63,19.2 54.73,19.11 55.01,18.82 55.55,18.29 R4.1
  Top 0.508: R4.1 55.24,18.16 55.01,18.82 55.7,18.69 R4.1 | T3.2 54.87,28.06 54.63,27.4 54.17,27.93 T3.2 | R4.1 55.27,18.1 54.73,19.11 55.78,18.66 R4.1 | T3.2 54.88,28.11 54.63,26.98 54.12,28.01 T3.2
N$6
  Top 0.254: T2.2 42.29,35.2 43.09,35.2 43.5,35.2 46.18,35.2 49.08,38.11 49.37,38.4 49.84,38.86 R3.1
  Top 0.508: R3.1 50.07,38.46 49.37,38.4 49.67,39.03 R3.1 | T2.2 42.42,35.44 43.09,35.2 42.56,34.74 T2.2 | R3.1 50.17,38.48 49.08,38.11 49.69,39.08 R3.1 | T2.2 42.38,35.45 43.5,35.2 42.47,34.69 T2.2
N$8
  Top 0.254: T1.3 44.81,26.52 44.81,25.87 44.81,25.46 44.81,12.34 43.59,11.13 43.27,10.8 42.75,10.29 SG2.+
  Top 0.508: T1.3 45.27,26.4 44.81,25.87 44.57,26.54 T1.3 | SG2.+ 42.89,10.91 43.27,10.8 43.43,10.45 SG2.+ | T1.3 45.32,26.49 44.81,25.46 44.56,26.58 T1.3 | SG2.+ 42.51,10.92 43.59,11.13 43.49,10.04 SG2.+
N$9
  Top 0.254: T1.2 43.2,28.12 43.85,28.12 44.26,28.12 47.09,28.12 49.14,30.16 49.43,30.45 49.84,30.86 R2.2
  Top 0.508: T1.2 43.17,28.33 43.85,28.12 43.33,27.64 T1.2 | R2.2 50.12,30.59 49.43,30.45 49.65,31.12 R2.2 | T1.2 43.13,28.34 44.26,28.12 43.24,27.58 T1.2 | R2.2 50.2,30.61 49.14,30.16 49.68,31.18 R2.2
PE  (via drill 0.61)
  Top 0.254: SV5.5 66.98,61.04 69.27,61.04 SV5.6 69.49,61.04 71.78,61.04 SV5.7 72.01,60.81 72.24,60.58 72.24,56.05 72.24,55.69 72.24,55.09 C4.- 72.24,54.86 71.88,54.5 71.62,54.25 71.32,53.95 71.32,52.81 71.78,52.35 71.78,49.61 SV4.6 72.01,49.38 72.01,45.49 74.52,42.98 74.52,41.15 73.61,40.23 73.38,40.23 72.47,39.32 X6.3 | 61.72,18.75 56.46,24 56.46,25.71 56.46,26.11 56.46,26.75 T3.3 | 61.72,18.75 IC5.2 61.72,15.09 57.84,11.2 57.84,9.7 57.84,9.35 57.84,8.69 C1.- 57.84,8.46 57.84,7.93 57.84,7.57 57.84,3.84 57.84,3.48 57.84,2.97 C2.- 57.84,2.74 57.47,2.37 57.21,2.12 56.24,1.14 53.28,1.14 52.87,1.14 52.12,1.14 R1.1 51.89,1.14 51.27,1.14 50.86,1.14 45.03,1.14 43.59,2.59 43.27,2.91 42.75,3.43 SG2.- 42.52,3.66 41.76,3.66 41.3,3.66 37.95,3.66 36.9,4.7 36.62,4.99 36.12,5.49 D8.A 36.12,5.71 36.12,6.4 36.12,6.81 36.12,8 36.8,8.69 36.8,12.12 36.37,12.55 36.08,12.84 35.66,13.26 D6.A | 61.72,18.75 66.06,23.09 68.58,23.09 69.72,21.95 71.63,21.95 72.14,21.95 73.15,21.95 B1.- | 37.72,56.46 39.09,56.46 X5.1 37.72,56.46 | 37.72,56.46 32.46,56.46 X4.1 32.23,56.46 31.77,56.46 27.66,60.58 21.26,60.58 17.6,56.92 14.63,56.92 | SV2.5 12.12,61.27 14.4,61.27 SV2.6 | SV2.7 16.92,61.27 14.63,61.27 SV2.6 | 14.63,56.92 14.63,53.76 14.63,53.4 14.63,52.81 C3.- | 14.63,56.92 14.63,61.04 SV2.6 | T2.3 44.12,33.6 43.67,33.16 43.39,32.87 36.12,25.6 IC1.14 35.89,25.38 30.18,19.66 23.09,19.66 20.23,16.8 19.94,16.51 19.43,16 C5.1 | v10.29,8 10.29,8.91 | 10.29,8.91 10.29,9.22 | 10.29,9.22 10.29,17.14 11.2,18.06 11.43,18.06 12.57,19.2 IC4.15 | C6.1 19.43,9.37 20.12,9.37 20.52,9.37 22.86,9.37 24.23,8 26.52,8 27.69,9.37 27.66,9.6 28.35,10.29 29.03,10.29 29.72,9.6 29.72,6.54 29.72,6.4 29.5,6.19 29.03,5.71 D4.A
  Top 0.254: v37.72,51.66 37.72,52.58 | 37.72,52.58 37.72,52.88 | 37.72,52.88 37.72,56.46 | 10.29,8.91 9.94,8.16 v10.29,8 | 10.29,8.91 10.63,8.16 v10.29,8 | 37.72,52.58 37.37,51.82 v37.72,51.66 | 37.72,52.58 38.06,51.82 v37.72,51.66 | 10.29,9.22 9.93,8.12 v10.29,8 | 10.29,9.22 10.65,8.12 v10.29,8 | 37.72,52.88 37.36,51.78 v37.72,51.66 | 37.72,52.88 38.08,51.78 v37.72,51.66
  Top 0.508: R1.1 52.22,1.4 52.87,1.14 52.33,0.7 R1.1 | R1.1 51.81,0.7 51.27,1.14 51.92,1.4 R1.1 | B1.- 72.86,21.43 72.14,21.95 72.94,22.31 B1.- | C6.1 19.52,9.74 20.12,9.37 19.5,9.04 C6.1 | D6.A 35.96,13.53 36.08,12.84 35.42,13.08 D6.A | D8.A 36.47,5.68 36.62,4.99 35.95,5.2 D8.A | D8.A 35.73,5.81 36.12,6.4 36.43,5.77 D8.A | T2.3 44.34,33.4 43.67,33.16 43.8,33.85 T2.3 | D4.A 28.83,5.98 29.5,6.19 29.35,5.5 D4.A | SG2.- 41.91,3.29 41.76,3.66 41.95,4 SG2.- | SG2.- 43.43,3.27 43.27,2.91 42.89,2.81 SG2.- | T3.3 56.76,26.75 56.46,26.11 56.06,26.69 T3.3 | C5.1 19.24,16.4 19.94,16.51 19.68,15.85 C5.1 | C1.- 58.1,8.48 57.84,7.93 57.49,8.44 C1.- | C1.- 57.49,8.84 57.84,9.35 58.1,8.79 C1.- | C2.- 57.69,2.88 57.84,3.48 58.28,3.05 C2.- | C2.- 58.08,2.44 57.47,2.37 57.71,2.94 C2.- | C4.- 72.05,55.1 72.24,55.69 72.65,55.23 C4.- | C4.- 72.47,54.65 71.88,54.5 72.05,55.09 C4.- | C3.- 14.21,52.95 14.63,53.4 14.82,52.81 C3.- | R1.1 52.16,1.41 53.28,1.14 52.24,0.65 R1.1 | R1.1 51.9,0.65 50.86,1.14 51.98,1.41 R1.1 | B1.- 72.95,21.38 71.63,21.95 73.02,22.33 B1.- | C6.1 19.45,9.78 20.52,9.37 19.43,9.01 C6.1 | D6.A 35.94,13.62 36.37,12.55 35.36,13.11 D6.A | D8.A 36.44,5.75 36.9,4.7 35.88,5.23 D8.A | D8.A 35.69,5.74 36.12,6.81 36.46,5.71 D8.A | T2.3 44.39,33.43 43.39,32.87 43.82,33.94 T2.3 | D4.A 28.74,5.93 29.72,6.54 29.34,5.45 D4.A | SG2.- 42.15,2.97 41.3,3.66 42.2,4.28 SG2.- | SG2.- 43.49,3.68 43.59,2.59 42.51,2.8 SG2.- | T3.3 56.78,26.81 56.46,25.71 56.01,26.77 T3.3 | C5.1 19.16,16.38 20.23,16.8 19.66,15.8 C5.1 | C1.- 58.13,8.53 57.84,7.57 57.46,8.5 C1.- | C1.- 57.46,8.77 57.84,9.7 58.13,8.74 C1.- | C2.- 57.69,2.85 57.84,3.84 58.35,2.97 C2.-
  Top 0.508: C2.- 58.16,2.46 57.21,2.12 57.73,2.98 C2.- | C4.- 72.04,55.06 72.24,56.05 72.7,55.16 C4.- | C4.- 72.54,54.67 71.62,54.25 72.07,55.15 C4.- | C3.- 14.16,52.87 14.63,53.76 14.83,52.77 C3.-
  Bottom 0.254: X6.3 72.47,39.09 73.61,37.95 73.84,37.95 74.52,37.26 74.52,23.32 74.18,22.97 73.82,22.61 73.15,21.95 B1.- | C3.- 14.4,52.58 14,52.18 13.75,51.93 13.49,51.66 13.49,47.78 14.63,46.63 SV1.6 | 35.66,46.18 34.52,46.18 33.83,45.49 33.83,43.2 32.92,42.29 32.69,42.29 31.09,40.69 IC1.21 31.09,40.46 35.89,35.66 35.89,25.6 IC1.14 | 35.66,46.18 37.49,44.35 SV7.1 37.72,44.12 43.43,44.12 SV9.1 | C6.1 19.2,9.37 19.2,8.59 19.2,8.18 19.2,7.77 12.8,1.37 IC4.1 12.57,1.37 10.52,3.43 10.52,6.8 | v10.29,8 10.52,7.77 10.52,7.12 | v10.29,8 9.64,8.65 | 9.64,8.65 9.43,8.86 | 9.43,8.86 9.14,9.14 8.91,9.14 7.77,10.29 IC4.8 | 10.52,6.8 10.52,7.12 | D4.A 29.03,5.71 29.76,5.71 30.17,5.71 32.23,5.71 33.15,6.63 34.98,6.63 35.18,6.42 35.47,6.14 35.89,5.71 D8.A | D6.A 35.43,13.49 34.94,13.98 34.65,14.27 34.29,14.63 32.69,14.63 31.55,13.49 29.67,13.49 29.26,13.49 28.57,13.49 D2.A 28.35,13.49 27.84,14 27.55,14.29 25.83,16 20.52,15.75 20.12,16 C5.1 | 37.72,50.44 37.72,48.23 35.66,46.18 | 37.72,50.44 37.72,50.75 | 37.72,50.75 v37.72,51.66 | 9.64,8.65 9.93,7.87 v10.29,8 | 9.64,8.65 10.42,8.36 v10.29,8 | 10.52,7.12 10.66,7.93 v10.29,8 | 10.52,7.12 9.99,7.76 v10.29,8 | 37.72,50.75 38.06,51.51 v37.72,51.66 | 37.72,50.75 37.37,51.51 v37.72,51.66 | 9.43,8.86 9.95,7.83 v10.29,8 | 9.43,8.86 10.46,8.34 v10.29,8 | 10.52,6.8 10.66,7.95 v10.29,8 | 10.52,6.8 9.95,7.82 v10.29,8 | 37.72,50.44 38.08,51.55 v37.72,51.66 | 37.72,50.44 37.36,51.55 v37.72,51.66
  Bottom 0.508: B1.- 72.99,22.32 73.82,22.61 73.65,21.75 B1.- | C6.1 19.63,9.15 19.2,8.59 18.93,9.24 C6.1 | D6.A 35.18,13.32 34.94,13.98 35.63,13.86 D6.A | D8.A 35.68,5.47 35.47,6.14 36.16,5.99 D8.A | D2.A 28.64,13.82 29.26,13.49 28.66,13.12 D2.A | D2.A 28.06,13.33 27.84,14 28.53,13.86 D2.A | D4.A 29.1,5.97 29.76,5.71 29.21,5.27 D4.A | C5.1 19.51,16.35 20.12,16 19.51,15.65 C5.1 | C3.- 14.59,52.37 14,52.18 14.13,52.78 C3.- | B1.- 72.91,22.29 74.18,22.97 73.62,21.65 B1.- | C6.1 19.68,9.23 19.2,8.18 18.91,9.29 C6.1 | D6.A 35.2,13.27 34.65,14.27 35.71,13.84 D6.A | D8.A 35.71,5.4 35.18,6.42 36.23,5.96 D8.A | D2.A 28.57,13.85 29.67,13.49 28.59,13.08 D2.A | D2.A 28.09,13.27 27.55,14.29 28.61,13.84 D2.A | D4.A 29.05,5.98 30.17,5.71 29.13,5.22 D4.A | C5.1 19.44,16.39 20.52,15.75 19.44,15.37 C5.1 | C3.- 14.64,52.39 13.75,51.93 14.15,52.85 C3.-
RX_D1
  Top 0.254: X6.2 71.32,36.58 61.04,46.86 37.95,46.86 36.35,45.26 36.35,42.98 36.12,42.75 36.12,40.69 IC1.19
STEP1_1A
  Bottom 0.254: SV1.3 7.32,46.63 7.32,48.46 13.03,54.18 26.29,54.18 SV3.2
STEP1_1B
  Top 0.254: SV1.2 4.57,46.41 6.86,44.12 18.75,44.12 26.29,51.66 SV3.1
STEP1_2A
  Top 0.254: SV1.4 9.83,46.41 11.66,44.58 17.83,44.58 24.46,51.21 24.46,54.86 26.29,56.69 SV3.3
STEP1_2B
  Top 0.254: SV1.5 25.15,59.44 SV3.4
STEP1_DIR_A4  (via drill 0.61)
  Top 0.254: 12.57,38.08 12.57,38.41 12.53,38.44 | 12.57,38.08 12.57,37.57 | 12.57,37.57 12.57,37.26 | 12.57,37.26 v12.57,36.35 | v11.89,39.09 12.53,38.44 | 10.97,51.66 10.97,51.89 10.9,51.97 | 10.97,51.66 v10.97,50.75 | 10.9,51.97 1.83,61.04 SV2.1 | 12.57,37.26 12.23,36.51 v12.57,36.35 | 12.57,37.26 12.92,36.51 v12.57,36.35 | 12.53,38.44 12.24,39.22 v11.89,39.09 | 12.53,38.44 11.76,38.73 v11.89,39.09 | 10.97,51.66 10.63,50.91 v10.97,50.75 | 10.97,51.66 11.32,50.91 v10.97,50.75 | 12.57,37.57 12.21,36.47 v12.57,36.35 | 12.57,37.57 12.94,36.47 v12.57,36.35 | 12.57,38.08 12.25,39.2 v11.89,39.09 | 12.57,38.08 11.65,38.79 v11.89,39.09 | 10.9,51.97 10.6,50.85 v10.97,50.75 | 10.9,51.97 11.33,50.89 v10.97,50.75
  Bottom 0.254: v12.57,36.35 13.22,35.7 | 13.22,35.7 13.44,35.48 | 13.44,35.48 20.8,28.12 20.8,25.6 IC1.8 | 11.89,40.31 11.89,44.35 10.97,45.26 10.97,49.53 | 11.89,40.31 11.89,40.01 | 11.89,40.01 v11.89,39.09 | v10.97,50.75 10.97,49.84 | 10.97,49.84 10.97,49.53 | 13.22,35.7 12.93,36.48 v12.57,36.35 | 13.22,35.7 12.44,35.99 v12.57,36.35 | 11.89,40.01 11.54,39.25 v11.89,39.09 | 11.89,40.01 12.23,39.25 v11.89,39.09 | 10.97,49.84 11.32,50.59 v10.97,50.75 | 10.97,49.84 10.63,50.59 v10.97,50.75 | 13.44,35.48 12.91,36.52 v12.57,36.35 | 13.44,35.48 12.4,36.01 v12.57,36.35 | 11.89,40.31 11.53,39.21 v11.89,39.09 | 11.89,40.31 12.25,39.21 v11.89,39.09 | 10.97,49.53 11.34,50.63 v10.97,50.75 | 10.97,49.53 10.61,50.63 v10.97,50.75
STEP1_EN_A0  (via drill 0.61)
  Top 0.254: v19.2,38.63 18.56,37.99 | 18.56,37.99 18.34,37.77 | 18.34,37.77 10.74,30.18 10.74,25.6 IC1.4 | v15.77,57.84 16.23,57.84 16.61,58.21 | 16.83,58.44 19.43,61.04 SV2.8 | 16.83,58.44 16.61,58.21 | 18.56,37.99 19.34,38.28 v19.2,38.63 | 18.56,37.99 18.84,38.77 v19.2,38.63 | 16.61,58.21 15.78,58.22 v15.77,57.84 | 16.61,58.21 16.06,57.59 v15.77,57.84 | 18.34,37.77 19.37,38.29 v19.2,38.63 | 18.34,37.77 18.86,38.8 v19.2,38.63 | 16.83,58.44 15.7,58.21 v15.77,57.84 | 16.83,58.44 16.06,57.58 v15.77,57.84
  Bottom 0.254: 17.98,38.63 15.32,38.63 14.86,38.18 10.74,38.18 9.37,39.55 9.37,41.83 5.94,45.26 5.94,48.01 14.91,56.97 | 17.98,38.63 18.29,38.63 | 18.29,38.63 v19.2,38.63 | v15.77,57.84 15.13,57.19 | 15.13,57.19 14.91,56.97 | 18.29,38.63 19.04,38.29 v19.2,38.63 | 18.29,38.63 19.04,38.98 v19.2,38.63 | 15.13,57.19 15.91,57.48 v15.77,57.84 | 15.13,57.19 15.42,57.97 v15.77,57.84 | 17.98,38.63 19.08,38.27 v19.2,38.63 | 17.98,38.63 19.08,38.99 v19.2,38.63 | 14.91,56.97 15.95,57.5 v15.77,57.84 | 14.91,56.97 15.43,58.01 v15.77,57.84
STEP1_L_SW_A1
  Bottom 0.254: IC1.5 13.03,25.6 13.03,28.35 1.83,39.55 1.83,43.89 3.43,45.49 3.43,50.52 12.12,59.21 23.77,59.21 25.38,60.81 31.77,60.81 32.23,61.27 X4.3
STEP1_R_SW_A2  (via drill 0.61)
  Top 0.254: 18.29,29.34 18.29,32.46 21.72,35.89 21.46,36.91 | 18.29,29.34 18.29,29.03 | 18.29,29.03 v18.29,28.12 | v21.72,38.89 21.72,37.72 | 21.72,37.72 21.46,36.91 | 18.29,29.03 17.94,28.28 v18.29,28.12 | 18.29,29.03 18.63,28.28 v18.29,28.12 | 21.72,37.72 22.06,38.48 v21.72,38.89 | 21.72,37.72 21.37,38.73 v21.72,38.89 | 18.29,29.34 17.93,28.24 v18.29,28.12 | 18.29,29.34 18.65,28.24 v18.29,28.12 | 21.46,36.91 21.82,38.26 v21.72,38.89 | 21.46,36.91 21.36,38.26 v21.72,38.89
  Bottom 0.254: v18.29,28.12 17.64,27.47 | 17.64,27.47 17.43,27.26 | 17.43,27.26 15.77,25.6 IC1.6 | v21.72,38.89 21.72,39.32 21.92,39.52 | 22.42,39.77 22.17,39.78 22.17,41.83 34.29,53.95 34.98,53.95 35.43,54.41 35.43,56.01 32.46,58.98 X4.2 | 22.42,39.77 21.92,39.52 | 17.64,27.47 18.42,27.76 v18.29,28.12 | 17.64,27.47 17.93,28.25 v18.29,28.12 | 21.92,39.52 21.41,38.87 v21.72,38.89 | 21.92,39.52 22.09,38.71 v21.72,38.89 | 17.43,27.26 18.46,27.78 v18.29,28.12 | 17.43,27.26 17.95,28.29 v18.29,28.12 | 22.42,39.77 21.42,39.13 v21.72,38.89 | 22.42,39.77 22.1,38.61 v21.72,38.89
STEP1_STEP_A5  (via drill 0.61)
  Top 0.254: 14.86,38.3 14.86,38.63 v14.4,39.09 | 14.86,38.3 14.86,37.96 | 14.86,37.96 14.86,37.57 | 14.86,37.57 14.86,37.26 | 14.86,37.26 v14.86,36.35 | v13.03,52.81 12.57,52.81 12.2,53.18 | 11.97,53.41 4.34,61.04 SV2.2 | 11.97,53.41 12.2,53.18 | 14.86,37.26 14.51,36.51 v14.86,36.35 | 14.86,37.26 15.21,36.51 v14.86,36.35 | 14.86,38.3 14.78,39.13 v14.4,39.09 | 14.86,38.3 14.18,38.78 v14.4,39.09 | 12.2,53.18 12.74,52.56 v13.03,52.81 | 12.2,53.18 13.03,53.19 v13.03,52.81 | 14.86,37.57 14.5,36.47 v14.86,36.35 | 14.86,37.57 15.22,36.47 v14.86,36.35 | 14.86,37.96 14.78,39.12 v14.4,39.09 | 14.86,37.96 14.11,38.84 v14.4,39.09 | 11.97,53.41 12.75,52.55 v13.03,52.81 | 11.97,53.41 13.11,53.18 v13.03,52.81
  Bottom 0.254: v14.86,36.35 15.51,35.7 | 15.51,35.7 15.72,35.48 | 15.72,35.48 23.32,27.89 23.32,25.6 IC1.9 | 14.4,40.31 14.4,41.6 16.92,44.12 18.52,44.12 18.75,44.35 21.72,44.35 22.17,44.81 22.17,46.41 14.86,53.72 13.95,53.72 13.89,53.67 | 14.4,40.31 14.4,40.01 | 14.4,40.01 v14.4,39.09 | v13.03,52.81 13.68,53.45 | 13.68,53.45 13.89,53.67 | 15.51,35.7 15.22,36.48 v14.86,36.35 | 15.51,35.7 14.73,35.99 v14.86,36.35 | 14.4,40.01 14.05,39.25 v14.4,39.09 | 14.4,40.01 14.75,39.25 v14.4,39.09 | 13.68,53.45 12.9,53.16 v13.03,52.81 | 13.68,53.45 13.39,52.67 v13.03,52.81 | 15.72,35.48 15.2,36.52 v14.86,36.35 | 15.72,35.48 14.69,36.01 v14.86,36.35 | 14.4,40.31 14.04,39.21 v14.4,39.09 | 14.4,40.31 14.76,39.21 v14.4,39.09 | 13.89,53.67 12.86,53.15 v13.03,52.81 | 13.89,53.67 13.37,52.63 v13.03,52.81
STEP2_1A
  Top 0.254: SV4.3 64.24,49.61 64.24,52.35 62.64,53.95 46.18,53.95 SV6.2
STEP2_1B
  Top 0.254: SV4.2 61.72,49.61 59.89,51.44 46.18,51.44 SV6.1
STEP2_2A
  Top 0.254: SV4.4 66.75,49.61 66.75,50.52 60.81,56.46 46.18,56.46 SV6.3
STEP2_2B
  Top 0.254: SV4.5 60.35,58.52 46.63,58.52 SV6.4
STEP2_DIR_D7  (via drill 0.61)
  Top 0.254: 36.01,54.86 36.35,54.86 v36.8,55.32 | 36.01,54.86 35.74,54.86 | 35.74,54.86 35.67,54.86 | 35.67,54.86 35.43,54.86 | 35.43,54.86 v34.52,54.86 | 35.43,54.86 34.68,55.21 v34.52,54.86 | 35.43,54.86 34.68,54.52 v34.52,54.86 | 36.01,54.86 36.84,54.94 v36.8,55.32 | 36.01,54.86 36.49,55.54 v36.8,55.32 | 35.74,54.86 34.64,55.23 v34.52,54.86 | 35.74,54.86 34.64,54.5 v34.52,54.86 | 35.67,54.86 36.83,54.94 v36.8,55.32 | 35.67,54.86 36.56,55.61 v36.8,55.32
  Bottom 0.254: v34.52,54.86 33.87,54.22 | 33.87,54.22 33.66,54 | 33.66,54 23.55,43.89 18.97,43.89 15.77,40.69 IC1.27 | v36.8,55.32 37.49,55.32 37.7,55.12 | 37.7,55.12 37.72,55.09 38,55.09 | 38,55.09 42.06,55.09 45.03,58.06 53.72,58.06 56.46,60.81 SV5.1 | 33.87,54.22 34.65,54.51 v34.52,54.86 | 33.87,54.22 34.16,55 v34.52,54.86 | 37.7,55.12 37.04,55.62 v36.8,55.32 | 37.7,55.12 36.88,54.95 v36.8,55.32 | 33.66,54 34.69,54.52 v34.52,54.86 | 33.66,54 34.18,55.04 v34.52,54.86 | 38,55.09 36.99,55.65 v36.8,55.32 | 38,55.09 36.85,54.94 v36.8,55.32
STEP2_EN_D2  (via drill 0.61)
  Top 0.254: 34.59,46.41 36.8,46.41 43.2,52.81 61.19,52.81 | 34.59,46.41 34.29,46.41 | 34.29,46.41 v33.38,46.41 | v62.41,52.81 61.49,52.81 | 61.49,52.81 61.19,52.81 | 34.29,46.41 33.53,46.75 v33.38,46.41 | 34.29,46.41 33.53,46.06 v33.38,46.41 | 61.49,52.81 62.25,52.46 v62.41,52.81 | 61.49,52.81 62.25,53.15 v62.41,52.81 | 34.59,46.41 33.49,46.77 v33.38,46.41 | 34.59,46.41 33.49,46.04 v33.38,46.41 | 61.19,52.81 62.29,52.45 v62.41,52.81 | 61.19,52.81 62.29,53.17 v62.41,52.81
  Bottom 0.254: 32.16,46.33 32.23,46.41 32.46,46.41 | 32.16,46.33 28.57,42.75 28.57,40.69 IC1.22 | v33.38,46.41 32.46,46.41 | 63.63,52.81 66.29,52.81 74.3,60.81 SV5.8 | 63.63,52.81 63.32,52.81 | 63.32,52.81 v62.41,52.81 | 32.46,46.41 33.22,46.06 v33.38,46.41 | 32.46,46.41 33.22,46.75 v33.38,46.41 | 63.32,52.81 62.57,53.15 v62.41,52.81 | 63.32,52.81 62.57,52.46 v62.41,52.81 | 32.16,46.33 33.28,46.04 v33.38,46.41 | 32.16,46.33 33.23,46.76 v33.38,46.41 | 63.63,52.81 62.53,53.17 v62.41,52.81 | 63.63,52.81 62.53,52.45 v62.41,52.81
STEP2_L_SW_D4
  Bottom 0.254: IC1.24 23.55,40.69 27.2,44.35 28.12,44.35 35.89,52.12 35.89,56.01 38.63,58.75 39.09,58.75 X5.2
STEP2_R_SW_D3
  Top 0.254: IC1.23 26.06,40.69 26.06,41.15 32.69,47.78 35.2,47.78 41.38,53.95 41.38,59.44 39.32,61.49 X5.3
STEP2_STEP_D8  (via drill 0.61)
  Top 0.254: 22.12,44.4 24.69,41.83 24.69,39.55 25.38,38.86 26.52,38.86 27.2,39.55 27.2,41.6 32.92,47.32 35.43,47.32 44.12,56.01 44.12,59.66 44.81,60.35 54.86,60.35 56.24,58.98 57.15,58.98 58.98,60.81 SV5.2 | 22.12,44.4 21.91,44.62 | 21.91,44.62 v21.26,45.26 | 21.91,44.62 21.62,45.4 v21.26,45.26 | 21.91,44.62 21.13,44.91 v21.26,45.26 | 22.12,44.4 21.6,45.44 v21.26,45.26 | 22.12,44.4 21.09,44.92 v21.26,45.26
  Bottom 0.254: v21.26,45.26 20.34,45.26 | 20.34,45.26 20.04,45.26 | 20.04,45.26 18.97,45.26 18.29,44.58 16.69,44.58 13.26,41.15 13.26,40.69 IC1.28 | 20.34,45.26 21.1,44.92 v21.26,45.26 | 20.34,45.26 21.1,45.61 v21.26,45.26 | 20.04,45.26 21.14,44.9 v21.26,45.26 | 20.04,45.26 21.14,45.62 v21.26,45.26
TX_D0
  Bottom 0.254: IC1.18 38.63,40.46 52.58,40.46 56.69,36.35 69.95,36.35 72.24,34.06 X6.1